# EAGLE design pcb (EAGLE 6.5.0)
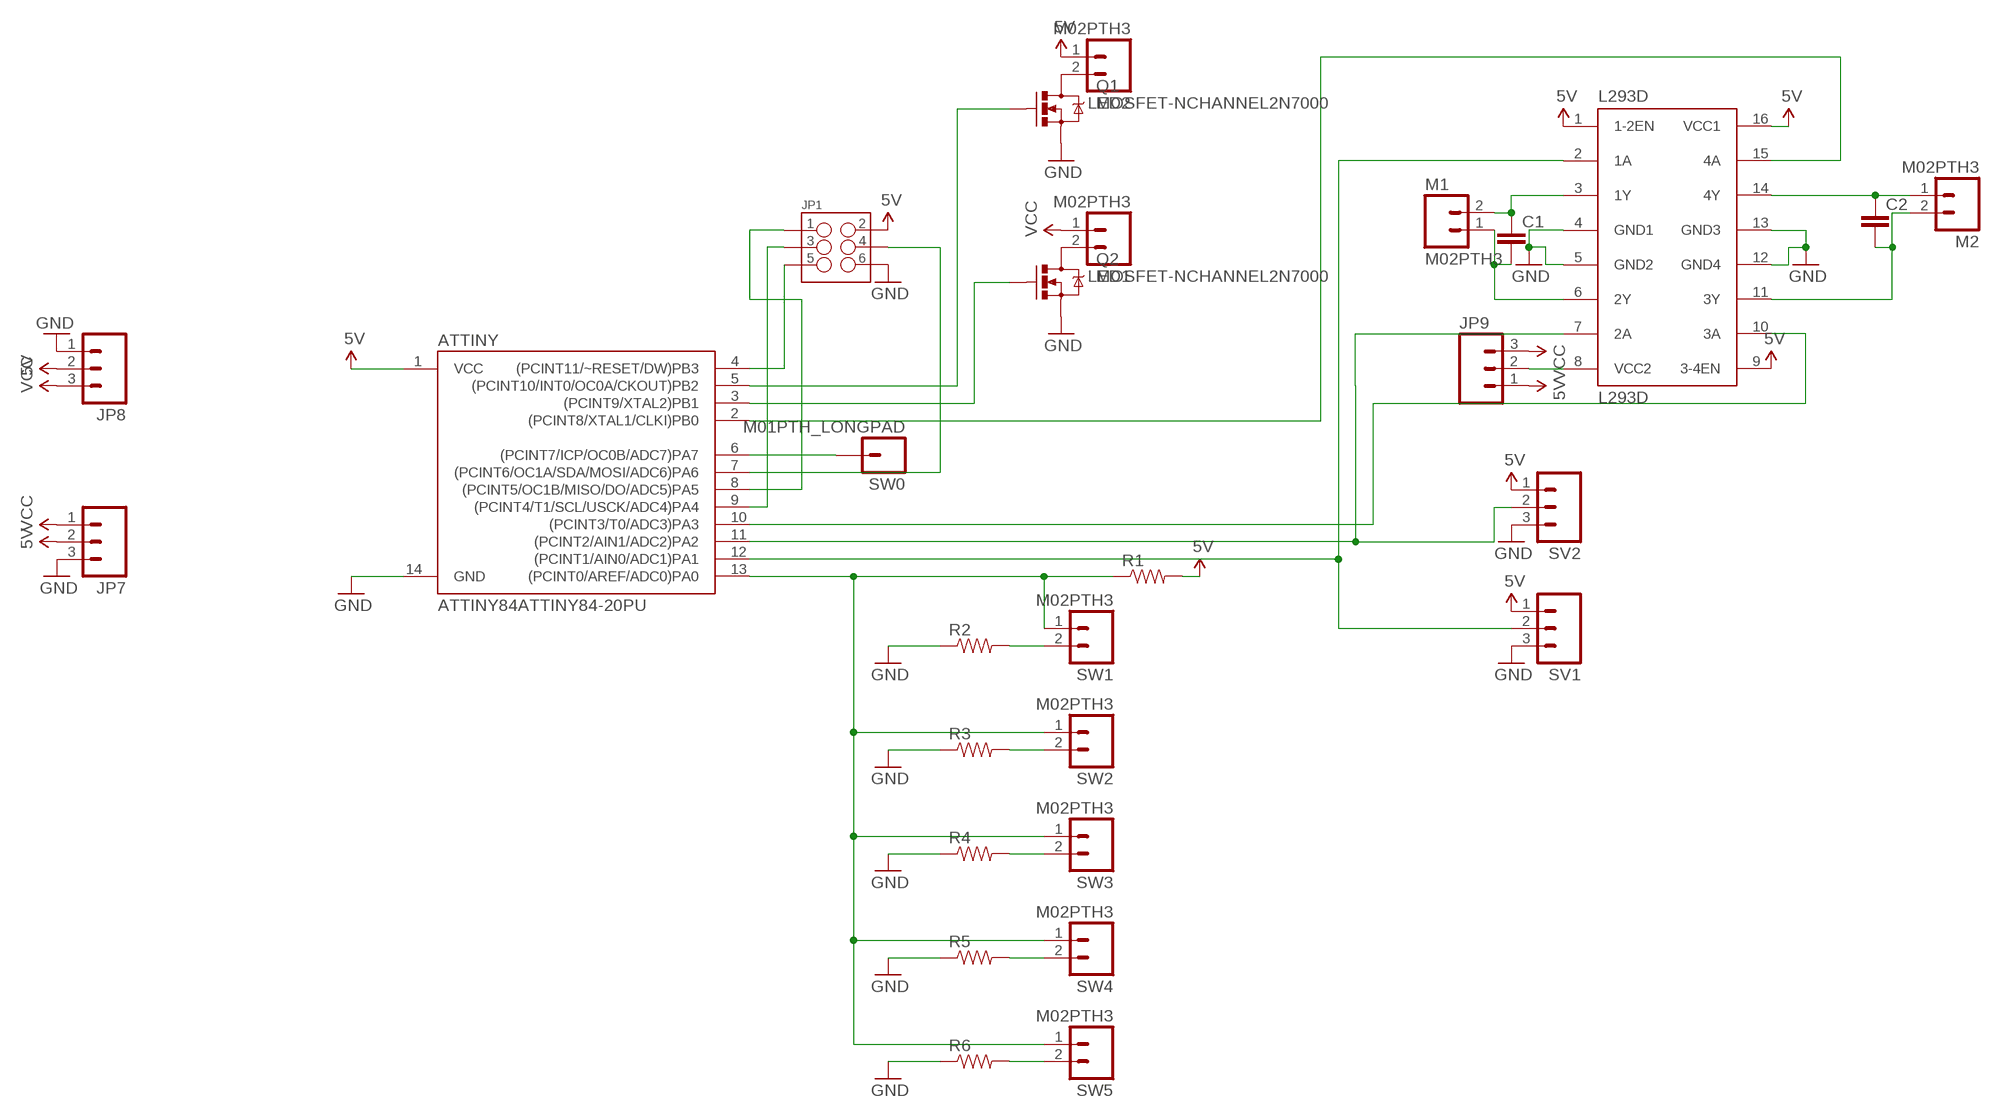
[diagram p0: schematic, sheet 1]

## Parts
ATTINY  ATTINY84ATTINY84-20PU  [DIL14]
C1  CAPPTH  [CAP-PTH-SMALL]
C2  CAPPTH  [CAP-PTH-SMALL]
JP1  M03X22X3_SILK_MALE_PTH  [2X3]
JP7  M03SCREW  [SCREWTERMINAL-3.5MM-3]
JP8  M03SCREW  [SCREWTERMINAL-3.5MM-3]
JP9  M03LONGPADS  [1X03_LONGPADS]
L293D  L293D  [DIL16]
LED1  M02PTH3  [1X02_LONGPADS]
LED2  M02PTH3  [1X02_LONGPADS]
M1  M02PTH3  [1X02_LONGPADS]
M2  M02PTH3  [1X02_LONGPADS]
Q1  MOSFET-NCHANNEL2N7000  [TO-92]
Q2  MOSFET-NCHANNEL2N7000  [TO-92]
R1  RESISTORPTH-1/4W  [AXIAL-0.4]
R2  RESISTORPTH-1/4W  [AXIAL-0.4]
R3  RESISTORPTH-1/4W  [AXIAL-0.4]
R4  RESISTORPTH-1/4W  [AXIAL-0.4]
R5  RESISTORPTH-1/4W  [AXIAL-0.4]
R6  RESISTORPTH-1/4W  [AXIAL-0.4]
SV1  M03LONGPADS  [1X03_LONGPADS]
SV2  M03LONGPADS  [1X03_LONGPADS]
SW0  M01PTH_LONGPAD  [1X01_LONGPAD]
SW1  M02PTH3  [1X02_LONGPADS]
SW2  M02PTH3  [1X02_LONGPADS]
SW3  M02PTH3  [1X02_LONGPADS]
SW4  M02PTH3  [1X02_LONGPADS]
SW5  M02PTH3  [1X02_LONGPADS]

## Nets
5V: ATTINY.1(VCC) JP1.2 JP7.2 JP8.2 JP9.1 L293D.1(1-2EN) L293D.9(3-4EN) L293D.16(VCC1) LED2.1 R1.P$2 SV1.1 SV2.1
GND: ATTINY.14(GND) JP1.6 JP7.3 JP8.1 L293D.4(GND1) L293D.5(GND2) L293D.12(GND4) L293D.13(GND3) Q1.1(S) Q2.1(S) R2.P$1 R3.P$1 R4.P$1 R5.P$1 R6.P$1 SV1.3 SV2.3
N$1: C2.1 L293D.14(4Y) M2.1
N$2: ATTINY.11((PCINT2/AIN1/ADC2)PA2) L293D.7(2A) SV2.2
N$3: ATTINY.6((PCINT7/ICP/OC0B/ADC7)PA7) SW0.1
N$4: ATTINY.10((PCINT3/T0/ADC3)PA3) L293D.10(3A)
N$5: C2.2 L293D.11(3Y) M2.2
N$6: C1.1 L293D.3(1Y) M1.2
N$7: C1.2 L293D.6(2Y) M1.1
N$8: ATTINY.9((PCINT4/T1/SCL/USCK/ADC4)PA4) JP1.3
N$9: ATTINY.2((PCINT8/XTAL1/CLKI)PB0) L293D.15(4A)
N$10: ATTINY.13((PCINT0/AREF/ADC0)PA0) R1.P$1 SW1.1 SW2.1 SW3.1 SW4.1 SW5.1
N$11: ATTINY.12((PCINT1/AIN0/ADC1)PA1) L293D.2(1A) SV1.2
N$12: R2.P$2 SW1.2
N$13: R3.P$2 SW2.2
N$14: ATTINY.7((PCINT6/OC1A/SDA/MOSI/ADC6)PA6) JP1.4
N$15: ATTINY.4((PCINT11/~RESET/DW)PB3) JP1.5
N$16: ATTINY.8((PCINT5/OC1B/MISO/DO/ADC5)PA5) JP1.1
N$17: JP9.2 L293D.8(VCC2)
N$18: LED1.2 Q2.3(D)
N$19: LED2.2 Q1.3(D)
N$20: ATTINY.3((PCINT9/XTAL2)PB1) Q2.2(G)
N$21: ATTINY.5((PCINT10/INT0/OC0A/CKOUT)PB2) Q1.2(G)
N$22: R4.P$2 SW3.2
N$24: R5.P$2 SW4.2
N$26: R6.P$2 SW5.2
VCC: JP7.1 JP8.3 JP9.3 LED1.1

## Library data of the parts
ATTINY = SparkFun-DigitalIC:ATTINY84: Atmel 14-pin 2/4/8kB flash uC
C1 C2 = SparkFun-Passives:CAP: Capacitor Standard 0603 ceramic capacitor, and 0.1" leaded capacitor.
JP1 = SparkFun-Connectors:M03X2: 2x3 .1" header. Shrouded, with keying- CONN-10681 SMT- CONN-11415 Pogo pins- HW-11044; PROD_ID: CONN-09701
JP7-JP9 SV1 SV2 = SparkFun-Connectors:M03: Header 3 Standard 3-pin 0.1" header. Use with straight break away headers (SKU : PRT-00116), right angle break away headers (PRT-00553), swiss pins (PRT-00743), machine pins (PRT-00117), and female headers (PRT-00115). Molex polarized connector foot print use with SKU : PRT-08232 with associated crimp pins and housings.
L293D = st-microelectronics:L293D: PUSH-PULL 4 CHANNEL DRIVER; MPN: L293D; OC_FARNELL: 9589619; OC_NEWARK: 56P8249
LED1 LED2 M1 M2 SW1-SW5 = SparkFun-Connectors:M02: Standard 2-pin 0.1" header. Use with - straight break away headers ( PRT-00116) - right angle break away headers (PRT-00553) - swiss pins (PRT-00743) - machine pins (PRT-00117) - female headers (PRT-00115) Molex polarized connector foot print use with: PRT-08233 with associated crimp pins and housings. 2.54_SCREWTERM for use with PRT-10571. 3.5mm Screw Terminal footprints for PRT-08084 5mm Screw Terminal footprints for use with PRT-08432
Q1 Q2 = SparkFun-DiscreteSemi:MOSFET-NCHANNEL: Common NMOSFET Parts MFG P/N Store ID Prod ID FDD8780 TRANS-09984 SI7820DN TRANS-11055 FDS6630A IC-08089 2N7002PW TRANS-11151 FQP30N06L COM-10213 TRANS-10060 BSS123LT1G TRANS-08345 BSS138 TRANS-00830 BS170 2N7000
R1-R6 = SparkFun-Resistors:RESISTOR: Resistor Basic schematic elements and footprints for 0603, 1206, and PTH resistors.
SW0 = SparkFun-Connectors:M01: Header 1 Standard 1-pin 0.1" header. Use with straight break away headers (SKU : PRT-00116), right angle break away headers (PRT-00553), swiss pins (PRT-00743), machine pins (PRT-00117), and female headers (PRT-00115).

## Board
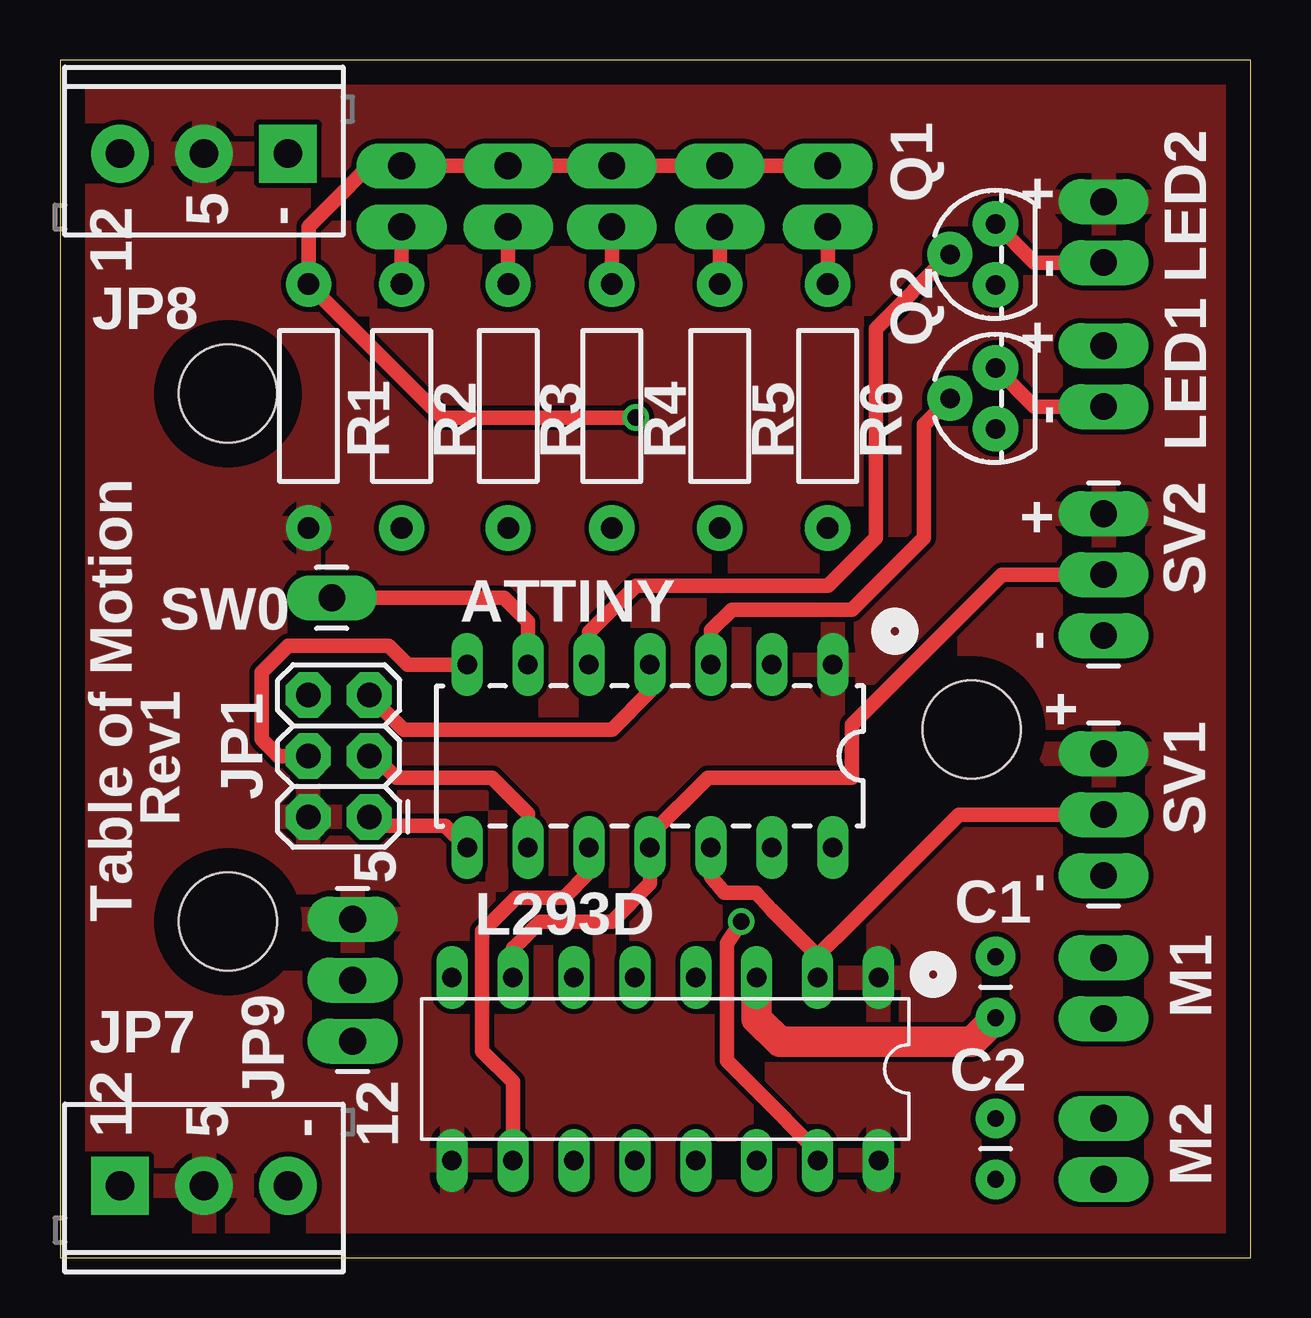
[diagram p1: board, top side]
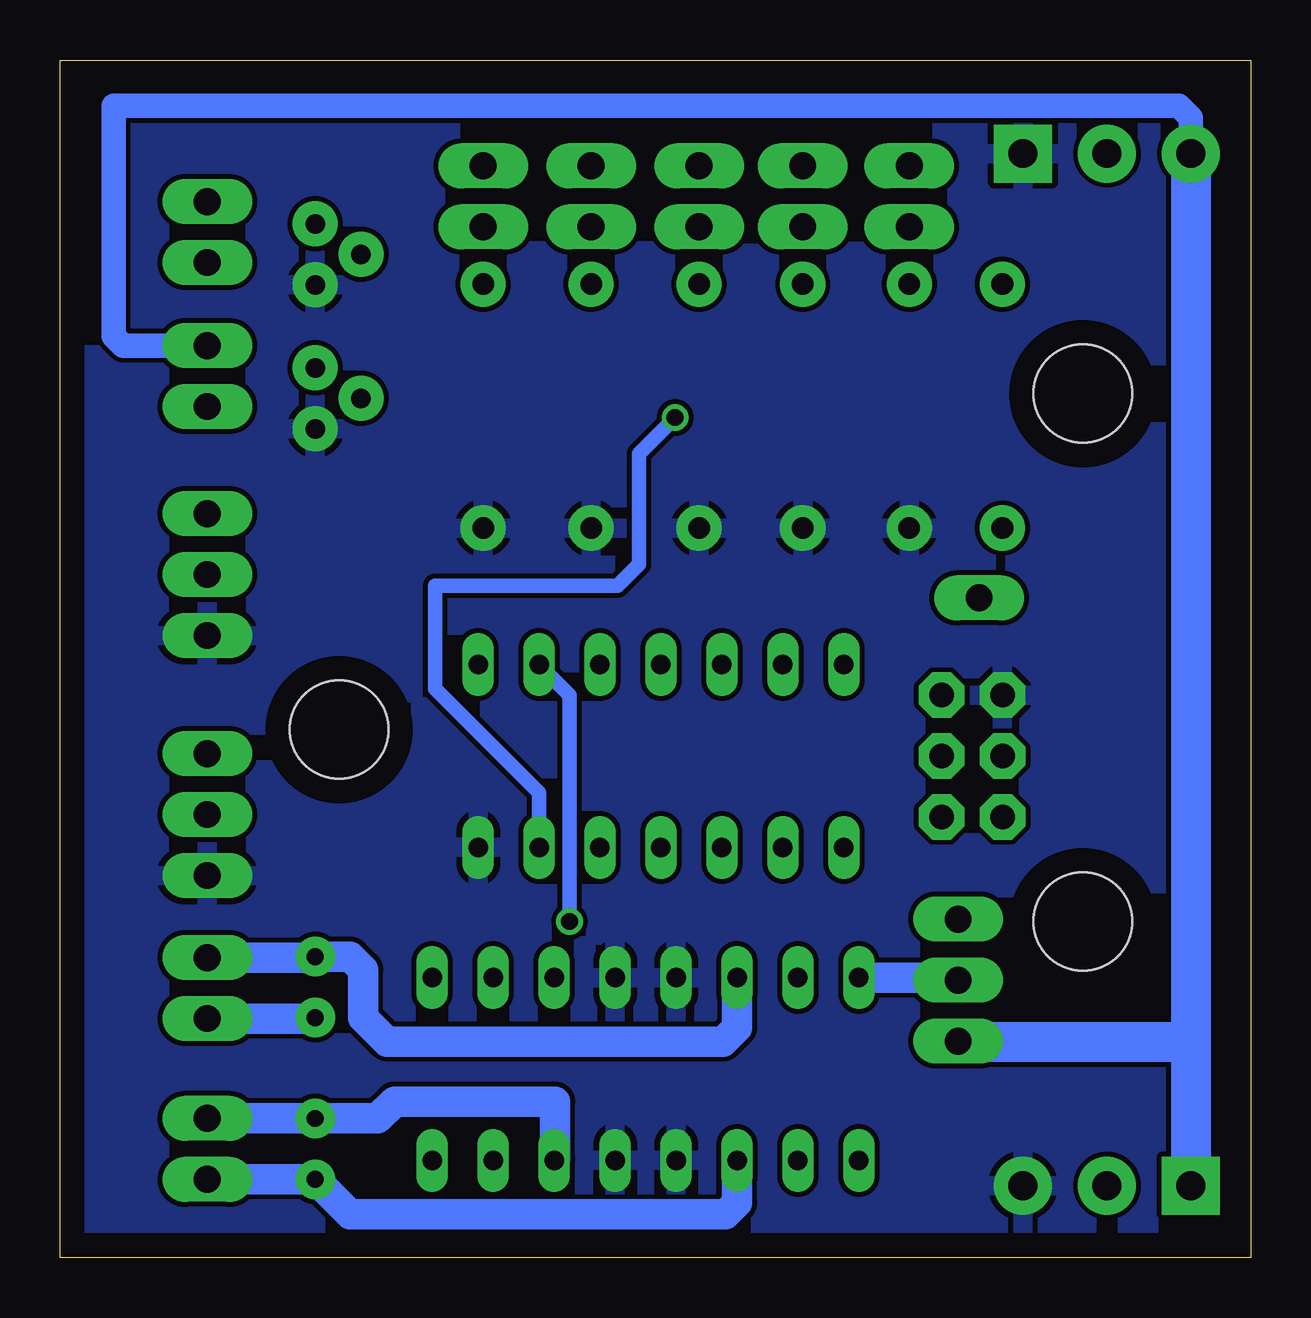
[diagram p2: board, bottom side, seen from below]

Size 49.64 x 49.9 mm. Coordinates in mm from the lower left corner, seen from the top.
Outline: 0,0 49.64,0 49.64,49.9 0,49.9 0,0
Copper layers (1*16): Top 0.035mm / dielectric 1.5mm / Bottom 0.035mm
Design rules "default": minimum track width 10mil, minimum drill 24mil, track to track 8mil, track to pad 8mil, pad to pad 8mil, via to via 8mil, smd to smd 8mil, copper to edge 40mil, drill to drill 8mil, minimum pad ring 10mil, minimum via ring 8mil, stop-mask expansion 4mil, vias tented up to drill 0mil, thermal gap 10mil
Holes 4.1 mm at 7,36 7,14 38,22

### Footprints (pad centres in the part's own frame; a part is rotated, then mirrored left to right if it is on the bottom)
DIL14 = drill 0.813 long: 1 -8.89,-3.81; 2 -6.35,-3.81; 3 -3.81,-3.81; 4 -1.27,-3.81; 5 1.27,-3.81; 6 3.81,-3.81; 7 6.35,-3.81; 8 6.35,3.81; 9 3.81,3.81; 10 1.27,3.81; 11 -1.27,3.81; 12 -3.81,3.81; 13 -6.35,3.81; 14 -8.89,3.81
CAP-PTH-SMALL = drill 0.7 pad 1.651: 1 0,0; 2 2.54,0
2X3 = drill 1.016 pad 1.88 octagon: 1 0,0; 2 0,2.54; 3 2.54,0; 4 2.54,2.54; 5 5.08,0; 6 5.08,2.54
SCREWTERMINAL-3.5MM-3 = drill 1.2 pad 2.413 square: 1 0,0 | drill 1.2 pad 2.413: 2 3.5,0; 3 7,0
1X03_LONGPADS = drill 1.118 pad 1.88 long: 1 0,0; 2 2.54,0; 3 5.08,0
DIL16 = drill 0.813 long: 1 -8.89,-3.81; 2 -6.35,-3.81; 3 -3.81,-3.81; 4 -1.27,-3.81; 5 1.27,-3.81; 6 3.81,-3.81; 7 6.35,-3.81; 8 8.89,-3.81; 9 8.89,3.81; 10 6.35,3.81; 11 3.81,3.81; 12 1.27,3.81; 13 -1.27,3.81; 14 -3.81,3.81; 15 -6.35,3.81; 16 -8.89,3.81
1X02_LONGPADS = drill 1.118 pad 1.88 long: 1 0,0; 2 2.54,0
TO-92 = drill 0.813 pad 1.88: 1 -1.27,0; 2 0,1.905; 3 1.27,0
AXIAL-0.4 = drill 0.9 pad 1.88: P$1 -5.08,0; P$2 5.08,0
1X01_LONGPAD = drill 1.118 pad 1.88 long: 1 0,0

### Placement (x,y rotation side)
ATTINY  23.32,20.9 180 top
C1  39,10 90 top
C2  39,5.8 270 top
JP1  12.89,18.36 90 top
JP7  2.5,3 0 top
JP8  9.5,46 180 top
JP9  12.2,14.1 270 top
L293D  25.23,7.86 180 top
LED1  43.5,38 270 top
LED2  43.5,44 270 top
M1  43.5,12.5 270 top
M2  43.5,5.8 270 top
Q1  39,41.8 90 top
Q2  39,35.8 90 top
R1  10.36,35.48 270 top
R2  14.24,35.48 90 top
R3  18.68,35.48 90 top
R4  23,35.48 90 top
R5  27.5,35.48 90 top
R6  32,35.48 90 top
SV1  43.5,21 270 top
SV2  43.5,31 270 top
SW0  11.33,27.49 270 top
SW1  14.24,45.49 270 top
SW2  18.68,45.49 270 top
SW3  23,45.49 270 top
SW4  27.5,45.49 270 top
SW5  32,45.49 270 top

### Tracks (layer width: path | path; a pad name or v marks a point on that pad's centre or on a via)
5V
  pour Top: 0,0 50,0 50,50 0,50
GND
  pour Bottom: 0,0 50,0 50,50 0,50
N$1
  Bottom 1.27: M2.1 C2.1 36.4,5.8 35.7,6.5 29,6.5 29,4.09 L293D.14
N$2
  Top 0.61: SV2.2 41.46,28.46 39.26,28.46 39.2,28.4 36.5,25.7 33,22.2 33,20 27,20 24.59,17.59 ATTINY.11 24.59,15.59 23,14 20,14 19,13 18.88,12.88 L293D.7
N$3
  Top 0.61: SW0.1 18.51,27.49 19,27 19.51,26.49 ATTINY.6
N$4
  Top 0.61: ATTINY.10 22.05,16.05 21,15 19,15 18,14 17.6,13.6 17.6,8.6 18.88,7.32 L293D.10
N$5
  Bottom 1.27: M2.2 C2.2 37.54,1.8 33,1.8 21.9,1.8 21.42,2.28 L293D.11
N$6
  Top 1.27: L293D.3 29.04,9.96 30,9 38,9 C1.1
  Bottom 1.27: C1.1 39.04,9.96 M1.2
N$7
  Bottom 1.27: M1.1 39.04,12.5 C1.2 37.54,12.54 37,12 37,10 36,9 22,9 21.42,9.58 L293D.6
N$8
  Top 0.61: JP1.3 13.1,20.9 14,20 18,20 19,19 19.51,18.49 ATTINY.9
N$9  (via drill 0.7)
  Top 0.61: v28.4,14 27.8,13.1 27.8,8.2 29,7 31.58,4.42 L293D.15
  Bottom 0.61: ATTINY.2 28.4,23.44 v28.4,14
N$10  (via drill 0.7)
  Top 0.61: SW5.1 SW4.1 SW3.1 SW2.1 SW1.1 12.89,45.49 11.3,43.9 10.36,42.96 R1.P$1 15.92,35 v24,35
  Bottom 0.61: ATTINY.13 29.67,19.37 33,22.7 34,23.7 34,28 26.4,28 25.5,28.9 25.5,33.5 v24,35
N$11
  Top 0.61: ATTINY.12 27.13,15.87 27.7,15.2 29,15.2 29.66,14.5 31.58,12.58 | 31.58,11.42 L293D.2 31.58,12.58 | SV1.2 37.46,18.46 33,14 31.58,12.58
N$12
  Top 0.61: SW1.2 R2.P$2
N$13
  Top 0.61: SW2.2 R3.P$2
N$14
  Top 0.61: ATTINY.7 14.49,24.71 13.7,25.5 9.5,25.5 8.4,24.4 8.4,21.6 9,21 9.1,20.9 JP1.4
N$15
  Top 0.61: ATTINY.4 24.59,23.59 23,22 14.33,22 JP1.5
N$16
  Top 0.61: JP1.1 13.25,18 15,18 16.06,18 ATTINY.8
N$17
  Bottom 1.27: JP9.2 12.11,11.67 L293D.8
N$18
  Top 0.61: Q2.3 40.61,35.46 LED1.2
N$19
  Top 0.61: Q1.3 40.61,41.46 LED2.2
N$20
  Top 0.61: Q2.2 36,34.7 36,30 33,27 28,27 27.13,26.13 ATTINY.3
N$21
  Top 0.61: Q1.2 34,38.7 34,30 32,28 24,28 22.05,26.05 ATTINY.5
N$22
  Top 0.61: SW3.2 R4.P$2
N$24
  Top 0.61: SW4.2 R5.P$2
N$26
  Top 0.61: SW5.2 R6.P$2
VCC
  Bottom 1.016: LED1.1 47,38 47.4,38.4 47.4,48 3,48 2.5,47.5 JP8.3
  Bottom 1.676: JP8.3 2.5,25 2.5,9 | 2.5,9 JP7.1 | JP9.3 11.98,9 2.5,9

### Text on the board
tNames: LED2 | + | 5 | - | 12 | - | LED1 | + | - | + | - | + | Rev1 | 5 | - | Table of Motion | M1 | 12 | 5 | - | 12 | M2